# Altium project daq.PrjPcb
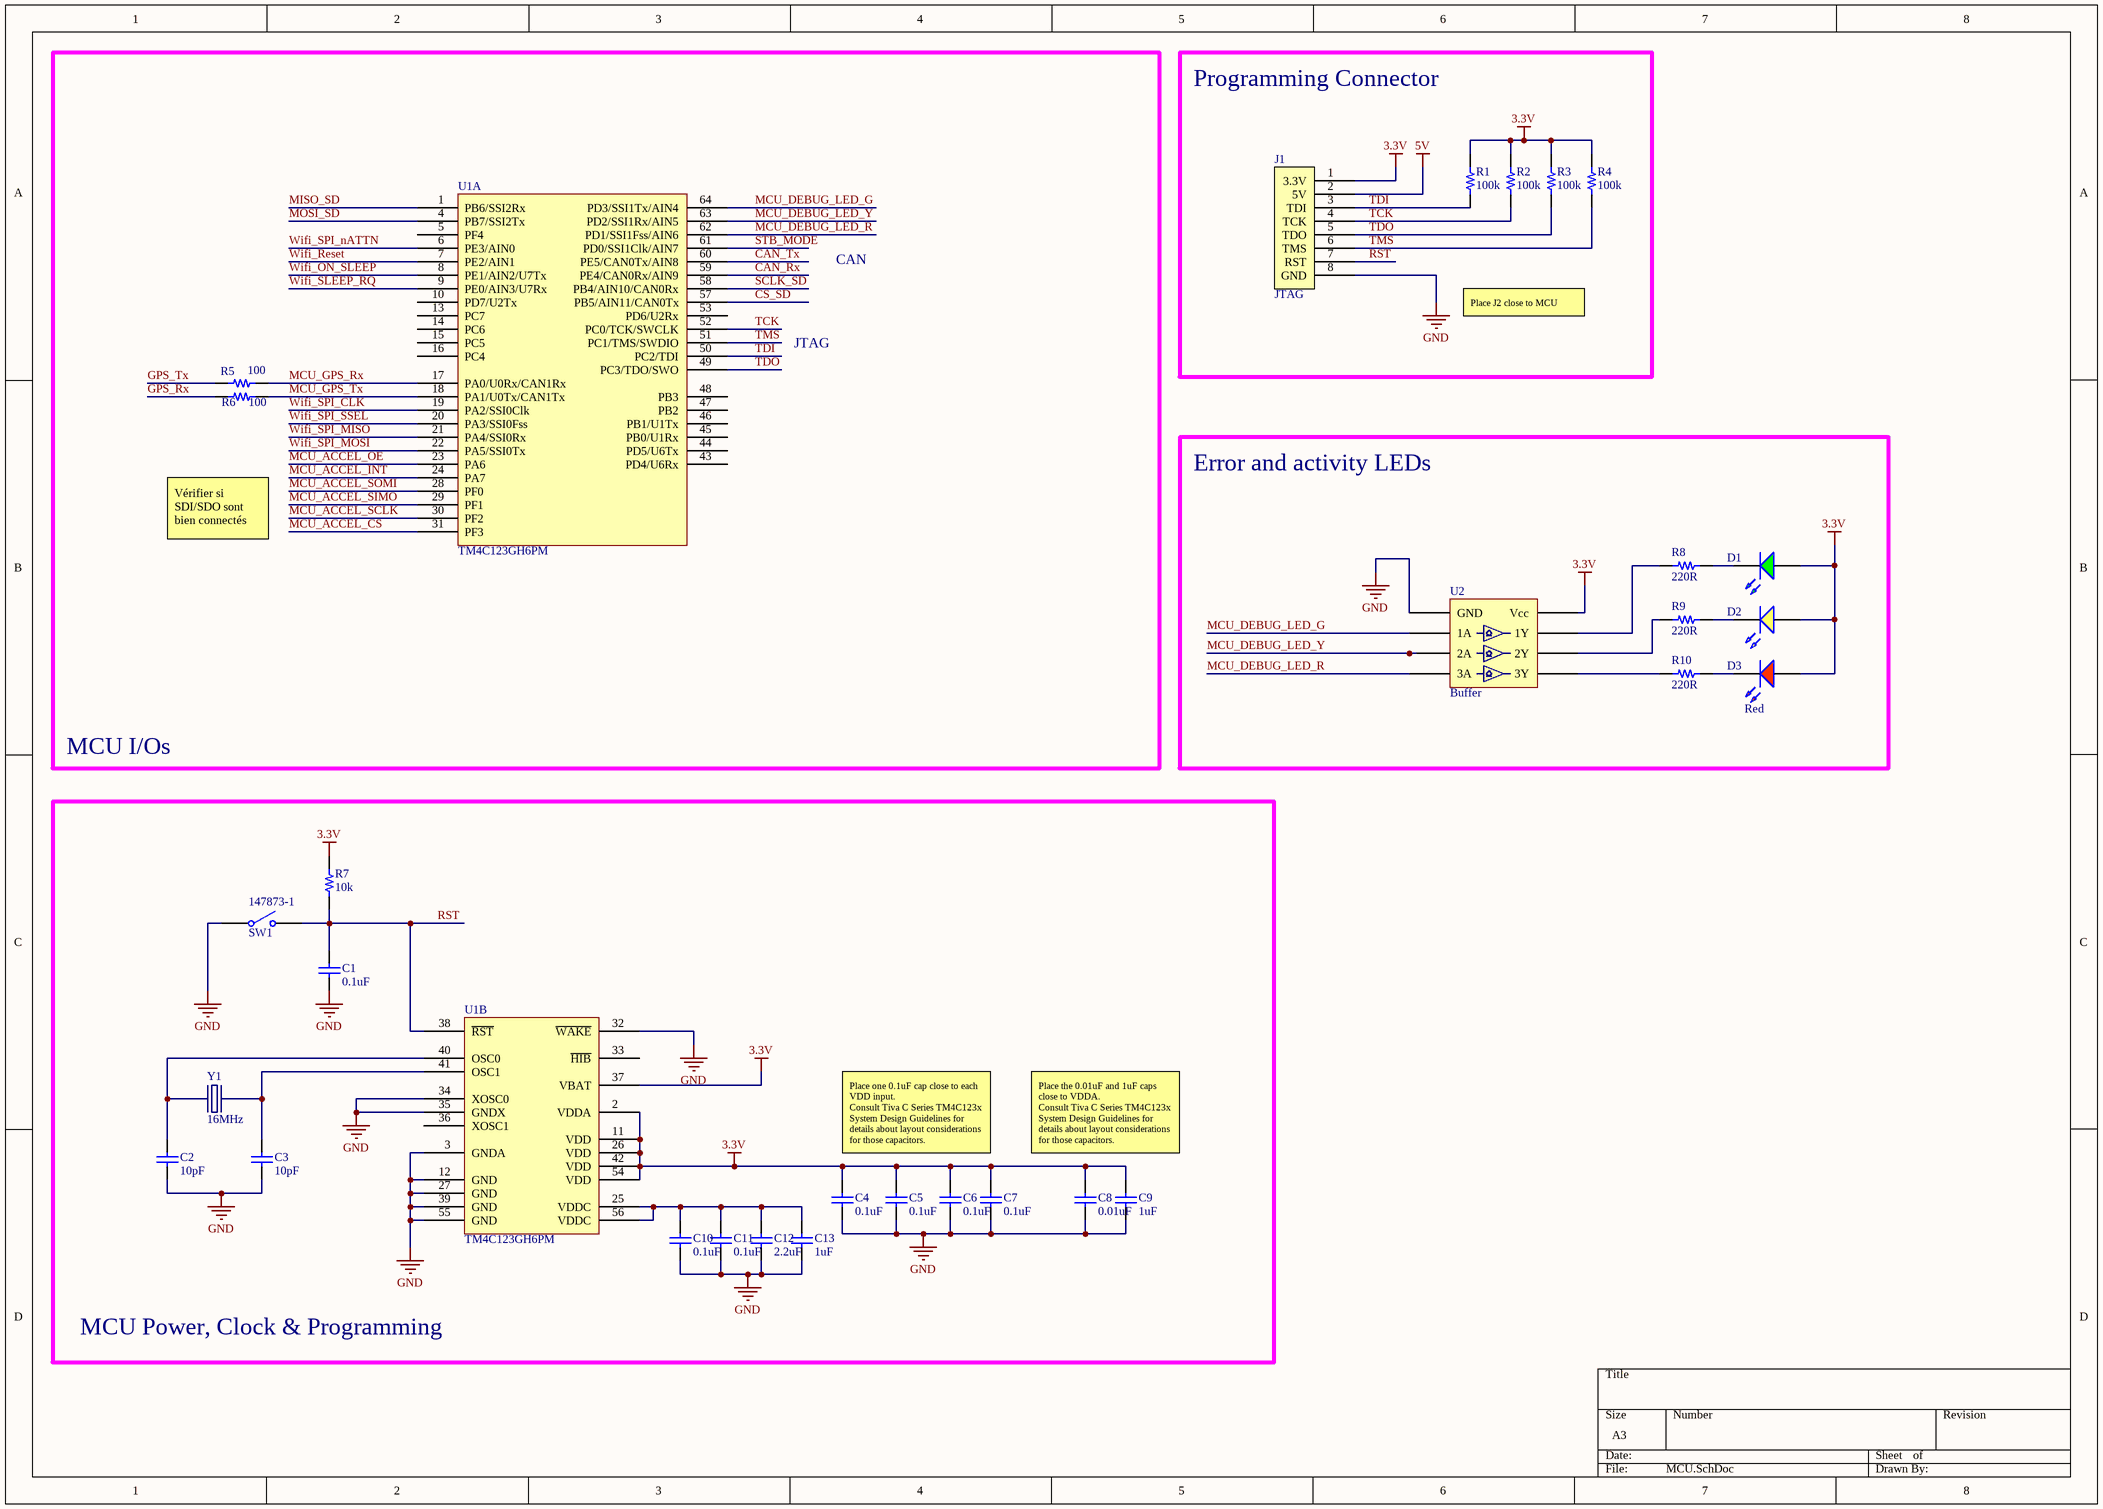
[diagram p0: MCU.SchDoc]
8 sheets, 90 parts. Net scope: global (net labels, ports and power ports of the same name join across sheets).
Board file: daq.PcbDoc
Sheets:
  MCU.SchDoc
  PowerSupplies.SchDoc
  CAN.SchDoc
  Connectors.SchDoc
  WifiModule.SchDoc
  SD_card.SchDoc
  Accelerometer.SchDoc
  GPS.SchDoc

## Sheet MCU.SchDoc
size A3

### Parts
C1  value 0.1uF  [C0603]  (hidden comment: CAP CER 0603 0.1uF 50V C0G 10%)
C2  value 10pF  [C0603]  (hidden comment: CAP CER 0603 10pF 50V C0G 5%)
C3  value 10pF  [C0603]  (hidden comment: CAP CER 0603 10pF 50V C0G 5%)
C4  value 0.1uF  [C0603]  (hidden comment: CAP CER 0603 0.1uF 50V C0G 10%)
C5  value 0.1uF  [C0603]  (hidden comment: CAP CER 0603 0.1uF 50V C0G 10%)
C6  value 0.1uF  [C0603]  (hidden comment: CAP CER 0603 0.1uF 50V C0G 10%)
C7  value 0.1uF  [C0603]  (hidden comment: CAP CER 0603 0.1uF 50V C0G 10%)
C8  value 0.01uF  [C0603]  (hidden comment: CAP CER 0603 0.01uF 50V X7R 10%)
C9  value 1uF  [C0603]  (hidden comment: CAP CER 0603 1uF 25V X7R 20%)
C10  value 0.1uF  [C0603]  (hidden comment: CAP CER 0603 0.1uF 50V C0G 10%)
C11  value 0.1uF  [C0603]  (hidden comment: CAP CER 0603 0.1uF 50V C0G 10%)
C12  value 2.2uF  [C0603]  (hidden comment: CAP CER 0603 2.2uF 6.3V X7R 10%)
C13  value 1uF  [C0603]  (hidden comment: CAP CER 0603 1uF 25V X7R 20%)
D1  Green LED  [LED1206]  (value not drawn)
D2  Yellow  [LED1206]  (value not drawn)
D3  Red  [LED1206]
J1  JTAG  [JTAG_Header]
R1  value 100k  [R0603]  (hidden comment: RES 0603 100k 5% 0.1W)
R2  value 100k  [R0603]  (hidden comment: RES 0603 100k 5% 0.1W)
R3  value 100k  [R0603]  (hidden comment: RES 0603 100k 5% 0.1W)
R4  value 100k  [R0603]  (hidden comment: RES 0603 100k 5% 0.1W)
R5  value 100  [R0603]  (hidden comment: RES 0603 100R 5% 1/4W)
R6  value 100  [R0603]  (hidden comment: RES 0603 100R 5% 1/4W)
R7  value 10k  [R0603]  (hidden comment: RES 0603 10k 5% 0.1W)
R8  value 220R  [R0603]  (hidden comment: RES 0603 220R 5% 0.25W)
R9  value 220R  [R0603]  (hidden comment: RES 0603 220R 5% 0.25W)
R10  value 220R  [R0603]  (hidden comment: RES 0603 220R 5% 0.25W)
SW1  147873-1  [147873]
U1  32-bit MCU  [LQFP-64]  (value not drawn)  (parts A,B of 2)
U2  Buffer  [8-VFSOP - TI - DCM (S-PDSO-G8)]
Y1  value 16MHz  [NX5032GA]  (hidden comment: NX5043GA-16.00MHz)

### Blocks framed on the sheet
MCU I/Os: R5 R6 U1
Programming Connector: J1 R1-R4
Error and activity LEDs: D1-D3 R8-R10 U2
MCU Power, Clock & Programming: C1-C13 R7 SW1 U1 Y1

### Nets
3.3V: C4.2 C5.2 C6.2 C7.2 C8.2 C9.2 D1.1(A) D2.1(A) D3.1(A) J1.1(3.3V) R1.2 R2.2 R3.2 R4.2 R7.2 U1.2(VDDA) U1.11(VDD) U1.26(VDD) U1.37(VBAT) U1.42(VDD) U1.54(VDD) U2.8(Vcc)
5V: J1.2(5V)
GND: C1.1 C2.1 C3.1 C4.1 C5.1 C6.1 C7.1 C8.1 C9.1 C10.1 C11.1 C12.1 C13.1 J1.8(GND) SW1.1(COMMON) U1.3(GNDA) U1.12(GND) U1.27(GND) U1.32(~{WAKE}) U1.34(XOSC0) U1.35(GNDX) U1.39(GND) U1.55(GND) U2.4(GND)
CAN_Rx: U1.59(PE4/CAN0Rx/AIN9)
CAN_Tx: U1.60(PE5/CAN0Tx/AIN8)
CS_SD: U1.57(PB5/AIN11/CAN0Tx)
GPS_Rx: R6.2
GPS_Tx: R5.2
MCU_ACCEL_CS: U1.31(PF3)
MCU_ACCEL_INT: U1.24(PA7)
MCU_ACCEL_OE: U1.23(PA6)
MCU_ACCEL_SCLK: U1.30(PF2)
MCU_ACCEL_SIMO: U1.29(PF1)
MCU_ACCEL_SOMI: U1.28(PF0)
MCU_DEBUG_LED_G: U1.64(PD3/SSI1Tx/AIN4) U2.1(1A)
MCU_DEBUG_LED_R: U1.62(PD1/SSI1Fss/AIN6) U2.6(3A)
MCU_DEBUG_LED_Y: U1.63(PD2/SSI1Rx/AIN5) U2.3(2A)
MCU_GPS_Rx: R5.1 U1.17(PA0/U0Rx/CAN1Rx)
MCU_GPS_Tx: R6.1 U1.18(PA1/U0Tx/CAN1Tx)
MISO_SD: U1.1(PB6/SSI2Rx)
MOSI_SD: U1.4(PB7/SSI2Tx)
RST: C1.2 J1.7(RST) R7.1 SW1.2(NO) U1.38(~{RST})
SCLK_SD: U1.58(PB4/AIN10/CAN0Rx)
STB_MODE: U1.61(PD0/SSI1Clk/AIN7)
TCK: J1.4(TCK) R2.1 U1.52(PC0/TCK/SWCLK)
TDI: J1.3(TDI) R1.1 U1.50(PC2/TDI)
TDO: J1.5(TDO) R3.1 U1.49(PC3/TDO/SWO)
TMS: J1.6(TMS) R4.1 U1.51(PC1/TMS/SWDIO)
Wifi_ON_SLEEP: U1.8(PE1/AIN2/U7Tx)
Wifi_Reset: U1.7(PE2/AIN1)
Wifi_SLEEP_RQ: U1.9(PE0/AIN3/U7Rx)
Wifi_SPI_CLK: U1.19(PA2/SSI0Clk)
Wifi_SPI_MISO: U1.21(PA4/SSI0Rx)
Wifi_SPI_MOSI: U1.22(PA5/SSI0Tx)
Wifi_SPI_nATTN: U1.6(PE3/AIN0)
Wifi_SPI_SSEL: U1.20(PA3/SSI0Fss)
NetC2_2: C2.2 U1.40(OSC0) Y1.1
NetC3_2: C3.2 U1.41(OSC1) Y1.2
NetC10_2: C10.2 C11.2 C12.2 C13.2 U1.25(VDDC) U1.56(VDDC)
NetD1_2: D1.2(K) R8.2
NetD2_2: D2.2(K) R9.2
NetD3_2: D3.2(K) R10.2
NetR8_1: R8.1 U2.7(1Y)
NetR9_1: R9.1 U2.5(2Y)
NetR10_1: R10.1 U2.2(3Y)

Not connected (* = marked no-connect by the designer): U1 5(PF4) 10(PD7/U2Tx) 13(PC7) 14(PC6) 15(PC5) 16(PC4) 33(~{HIB}) 36(XOSC1) 43(PD4/U6Rx) 44(PD5/U6Tx) 45(PB0/U1Rx) 46(PB1/U1Tx) 47(PB2) 48(PB3) 53(PD6/U2Rx)

### Notes on the sheet
- CAN
- Place J2 close to MCU
- JTAG
- Vérifier si SDI/SDO sont bien connectés
- Place one 0.1uF cap close to each VDD input.
  Consult Tiva C Series TM4C123x System Design Guidelines for details about layout considerations for those capacitors.
- Place the 0.01uF and 1uF caps close to VDDA.
  Consult Tiva C Series TM4C123x System Design Guidelines for details about layout considerations for those capacitors.

### Library data of the parts
C1 C4-C7 C10 C11 = CAP CER 0603 0.1uF 50V C0G 10%: 0.1uF ceramic capacitor; Manufacturer: TDK Corporation; Part_Number: CGA3E2X7R1H104K080AA; Supplier_Link: http://www.digikey.ca/product-detail/en/CGA3E2X7R1H104K080AA/445-5666-1-ND/2443706; Tolerance: 10%; Voltage rating: 50V; Price: 0.14; Price_10: 0.102
C2 C3 = CAP CER 0603 10pF 50V C0G 5%: 10pF ceramic capacitor; Manufacturer: TDK Corporation; Part_Number: CGA3E2C0G1H100D080AA; Supplier_Link: http://www.digikey.ca/product-detail/en/CGA3E2C0G1H100D080AA/445-5628-1-ND/2443668; Tolerance: 5%; Voltage rating: 50V; Price: 0.14; Price_10: 0.077
C8 = CAP CER 0603 0.01uF 50V X7R 10%: 0.01uF ceramic capacitor; Manufacturer: TDK Corporation; Part_Number: CGA3E2X7R1H103K080AA; Supplier_Link: http://www.digikey.ca/product-detail/en/CGA3E2X7R1H103K080AA/445-5662-1-ND/2443702; Tolerance: 10%; Voltage rating: 50V; Price: 0.14; Price_10: 0.102
C9 C13 = CAP CER 0603 1uF 25V X7R 20%: 1uF ceramic capacitor; Manufacturer: TDK Corporation; Part_Number: CGA3E1X7R1E105M080AC; Supplier_Link: http://www.digikey.ca/product-detail/en/CGA3E1X7R1E105M080AC/445-12548-1-ND/3954214; Tolerance: 20%; Voltage rating: 25V; Price: 0.24; Price_10: 0.171
C12 = CAP CER 0603 2.2uF 6.3V X7R 10%: 2.2uF ceramic capacitor; Manufacturer: TDK Corporation; Part_Number: CGA3E1X7R0J225K080AC; Supplier_Link: http://www.digikey.ca/product-detail/en/CGA3E1X7R0J225K080AC/445-6933-1-ND/2672951; Tolerance: 10%; Voltage rating: 6.3V; Price: 0.34; Price_10: 0.235
D1 = LTST-C150KGKT: Green LED 1206; Manufacturer: Liteon; Supplier_Link: http://www.digikey.ca/product-detail/en/LTST-C150KGKT/160-1404-1-ND/386759; Price: 0.55; Price_10: 0.40; Part_Number: LTST-C150KGKT
D2 = LTST-C150KSKT: Yellow LED 1206; Manufacturer: Liteon; Supplier_Link: http://www.digikey.ca/product-detail/en/LTST-C150KSKT/160-1406-1-ND/386762; Price: 0.55; Price_10: 0.40; Part_Number: LTST-C150KSKT
D3 = LTST-C150KRKT: Red LED 1206; Manufacturer: Liteon; Supplier_Link: http://www.digikey.ca/product-detail/en/LTST-C150KRKT/160-1405-1-ND/386760; Price: 0.55; Price_10: 0.40; Part_Number: LTST-C150KRKT
J1 = JTAG_Header: JTAG header, MCU programming
R1-R4 = RES 0603 100k 5% 0.1W: 100 kOhm resistor; Part_Number: CRCW0603100KJNEA; Manufacturer: Vishay; Price: 0.15; Supplier_Link: http://www.digikey.ca/product-detail/en/CRCW0603100KJNEA/541-100KGCT-ND/1179417; Price_10: 0.033
R5 R6 = RES 0603 100R 5% 1/4W: 100 Ohms resistor, 1/4W; Part_Number: ESR03EZPJ101; Manufacturer: Rohm Semiconductor; Price: 0.15; Supplier_Link: http://www.digikey.ca/product-detail/en/ESR03EZPJ101/RHM100DCT-ND/1983776; Price_10: 0.12
R7 = RES 0603 10k 5% 0.1W: 10 kOhms resistor; Part_Number: CRCW060310K0JNEA; Manufacturer: Vishay; Price: 0.15; Supplier_Link: http://www.digikey.ca/product-detail/en/CRCW060310K0JNEA/541-10KGCT-ND/1179393; Price_10: 0.033
R8-R10 = RES 0603 220R 5% 0.25W: 220 Ohms 0.25W Resistor; Part_Number: ESR03EZPJ221; Manufacturer: Rohm Semiconductor; Price: 0.15; Supplier_Link: http://www.digikey.ca/product-detail/en/ESR03EZPJ221/RHM220DCT-ND/1983788; Power: 0.25W; Supplier 1: Digi-Key; Supplier Part Number 1: RHM220DCT-ND; Tolerance: 5%
SW1 = 147873-1: Pushbutton switch SPST, 2 pins; Manufacturer: TE Connectivity; Supplier_Link: http://ca.mouser.com/ProductDetail/TE-Connectivity-Alcoswitch/147873-1/?qs=sGAEpiMZZMvxtGF7dlGNpsxRhg8g8FqHC2R98arEfD8%3d; Price: 0.30; Part_Number: 147873-1
U1 = TM4C123GH6PM: High performance 32-bit ARM® Cortex®-M4F based MCU; Manufacturer: Texas Instruments; Sample_Link: http://www.ti.com/product/TM4C123GH6PM/samplebuy; Supplier 1: Digi-Key; Supplier Part Number 1: 296-35848-ND; Supplier_Link: http://www.digikey.ca/product-detail/en/TM4C123GH6PMI/296-35848-ND/4036462; Price: 16.430; Price_10: 14.8320; Part_Number: TM4C123GH6PM
U2 = SN74LVC3G07-Q1: Triple Buffer/Driver  With Open-drain Outputs; Manufacturer: Texas Instrument; Part_Number: SN74LVC3G07QDCURQ1; Sink current: 32 mA @ 4.5V; Note: Q1 (automotive) version only available in TSSOP50 footpring; Supplier 1: Digi-Key; Supplier Part Number 1: 296-23710-1-ND; Supplier_Link: http://www.digikey.ca/product-detail/en/texas-instruments/SN74LVC3G07QDCURQ1/296-23710-1-ND/1948115; Price: 0.94; Price_10: 0.811
Y1 = NX5043GA-16.00MHz: Crystal Oscillator 16 MHz; Manufacturer: NDK; Part_Number: NX5032GA-16.000M-LN-CD-1; ESR: 120 Ohms; Supplier_Link: http://www.digikey.ca/product-detail/en/NX5032GA-16.000000MHZ-LN-CD-1/644-1037-1-ND/1128909; Price: 0.95; Price_10: 0.796

## Sheet PowerSupplies.SchDoc
size A4
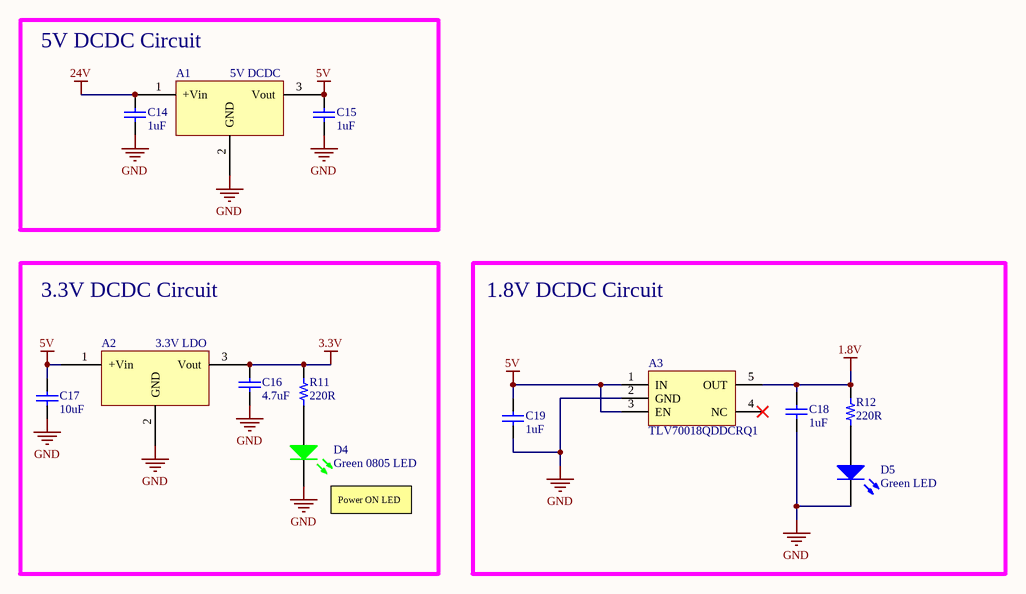
[diagram p1: PowerSupplies.SchDoc]

### Parts
A1  5V DCDC  [R-78E-0.5]
A2  3.3V LDO  [TO252-3]
A3  TLV70018QDDCRQ1  [SOT-23-5]
C14  value 1uF  [C0603]  (hidden comment: CAP CER 0603 1uF 25V X7R 20%)
C15  value 1uF  [C0603]  (hidden comment: CAP CER 0603 1uF 25V X7R 20%)
C16  value 4.7uF  [C0603]  (hidden comment: CAP CER 0603 4.7uF 25V X7R 10%)
C17  value 10uF  [C0603]  (hidden comment: CAP CER 0603 10uF 6.3V X5R 20%)
C18  value 1uF  [C0603]  (hidden comment: CAP CER 0603 1uF 16V X7R 10%)
C19  value 1uF  [C0603]  (hidden comment: CAP CER 0603 1uF 16V X7R 10%)
D4  Green 0805 LED  [LED0805]
D5  Green LED  [LED0603]
R11  value 220R  [R0603]  (hidden comment: RES 0603 220R 5% 0.25W)
R12  value 220R  [R0603]  (hidden comment: RES 0603 220R 5% 0.25W)

### Blocks framed on the sheet
5V DCDC Circuit: A1 C14 C15
3.3V DCDC Circuit: A2 C16 C17 D4 R11
1.8V DCDC Circuit: A3 C18 C19 D5 R12

### Nets
1.8V: A3.5(OUT) C18.2 R12.2
3.3V: A2.3(Vout) C16.2 R11.2
5V: A1.3(Vout) A2.1(+Vin) A3.1(IN) A3.3(EN) C15.2 C17.2 C19.2
24V: A1.1(+Vin) C14.2
GND: A1.2(GND) A2.2(GND) A3.2(GND) C14.1 C15.1 C16.1 C17.1 C18.1 C19.1 D4.1(K) D5.1(K)
NetD4_2: D4.2(A) R11.1
NetD5_2: D5.2(A) R12.1

Not connected (* = marked no-connect by the designer): A3 4(NC)*

### Notes on the sheet
- (near D4) Power ON LED

### Library data of the parts
A1 = R78E5.0-0.5: Manufacturer: Recom; Part_Number: R-78E5.0-0.5; Vin: 7-28V; Iout: 500mA; Efficiency: 82-92%; Supplier_Link: http://www.digikey.ca/product-detail/en/R-78E5.0-0.5/945-1648-5-ND/2834904; Vout: 5V; Price: 4.04; Price_10: 3.972
A2 = NCV5501DT33RKG: Linear Voltage Regulator IC Positive Fixed 1 Output 3.3V 500mA DPAK-3; Manufacturer: ON Semiconductor; Iout: 500 mA; Price: 1.33; Price_10: 1.194; Supplier 1: Digi-Key; Supplier_Link: http://www.digikey.ca/product-detail/en/on-semiconductor/NCV5501DT33RKG/NCV5501DT33RKGOSCT-ND/3462418; Supplier Part Number 1: NCV5501DT33RKGOSCT-ND; Vout: 3.3V; Part_Number: NCV5501DT33RKG
A3 = TLV70018QDDCRQ1: Linear Voltage Regulator IC Positive Fixed 1 Output 1.8V 300mA SOT-23-5; Manufacturer: Texas Instruments; Part_Number: TLV70018QDDCRQ1; Supplier_Link: https://www.digikey.ca/product-detail/en/texas-instruments/TLV70018QDDCRQ1/296-36761-1-ND/4341463
C14 C15 = CAP CER 0603 1uF 25V X7R 20%: as C9 on sheet MCU; Supplier_Link: http://www.digikey.ca/product-detail/en/CGA3E1X7R1E105M080AC/445-12548-1-ND/3954214; Tolerance: 20%; Voltage rating: 25V; Price: 0.24; Price_10: 0.171
C16 = CAP CER 0603 4.7uF 25V X7R 10%: 4.7uF ceramic capacitor; Manufacturer: Kernet; Part_Number: C1206C475K3RACAUTO; Supplier_Link: http://www.digikey.ca/product-detail/en/CGA3E3X7R1E474K080AB/445-6929-1-ND/2672947; Tolerance: 10%; Voltage rating: 25V; Price: 0.48; Supplier 1: Digi-Key; Supplier Part Number 1: 399-7029-1-ND; Price_10: 0.428
C17 = CAP CER 0603 10uF 6.3V X5R 20%: 10uF ceramic capacitor; Manufacturer: Taiyo Yuden; Part_Number: JMK107ABJ106MAHT; Supplier_Link: http://www.digikey.ca/product-detail/en/JMK107ABJ106MAHT/587-3383-1-ND/4157249; Tolerance: 20%; Voltage rating: 6.3V; Price: 0.30; Supplier 1: Digi-Key; Supplier Part Number 1: 587-3383-1-ND; Price_10: 0.205
C18 C19 = CAP CER 0603 1uF 16V X7R 10%: 1uF ceramic capacitor; Manufacturer: Samsung Electro-Mechanics; Part_Number: CL10B105KO8VPNC; Supplier_Link: https://www.digikey.ca/product-detail/en/samsung-electro-mechanics/CL10B105KO8VPNC/1276-6613-1-ND/5961472; Tolerance: 10%; Voltage rating: 16V; Price: 0.32; Supplier 1: Digi-Key; Supplier Part Number 1: 1276-6613-1-ND
D4 = APT2012LZGCK: Green 525nm LED Indication - Discrete 2.65V 0805 (2012 Metric); Manufacturer: Kingbright; Forward_Voltage: 2.65; Supplier_Link: http://www.digikey.ca/product-detail/en/kingbright/APT2012LZGCK/754-1939-1-ND/5177469; Price: 0.86; Price_10: 0.673; Part_Number: APT2012LZGCK; Supplier 1: Digi-Key; Supplier Part Number 1: 754-1939-1-ND
D5 = 150060VS75000: Green LED 0603, 2V, 20mA; Manufacturer: Wurth Electronics; Supplier_Link: http://www.digikey.ca/product-detail/en/wurth-electronics-inc/150060VS75000/732-4980-1-ND/4489904; Price: 0.34; Price_10: 0.3968; Part_Number: 150060VS75000
R11 R12 = RES 0603 220R 5% 0.25W: as R8 on sheet MCU; Price: 0.15; Supplier_Link: http://www.digikey.ca/product-detail/en/ESR03EZPJ221/RHM220DCT-ND/1983788; Power: 0.25W; Supplier 1: Digi-Key; Supplier Part Number 1: RHM220DCT-ND; Tolerance: 5%
  R11: Price_10: 0.12

## Sheet CAN.SchDoc
size A4
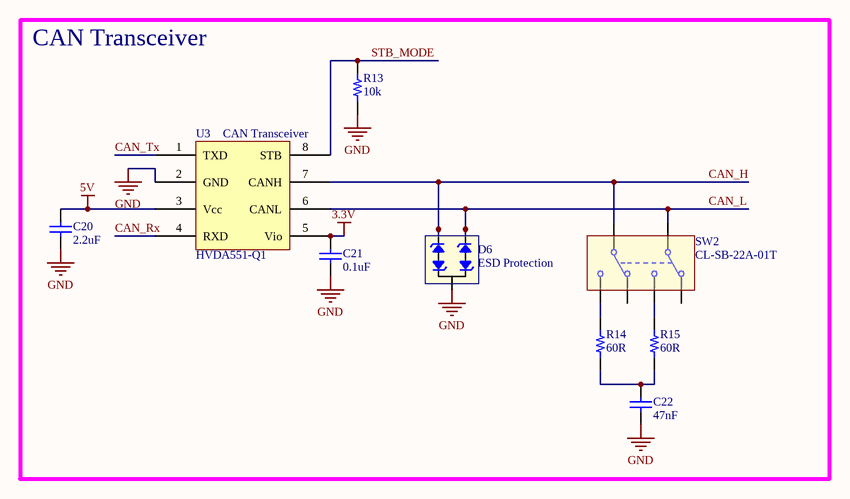
[diagram p2: CAN.SchDoc]

### Parts
C20  value 2.2uF  [C0603]  (hidden comment: CAP CER 0603 2.2uF 6.3V X7R 10%)
C21  value 0.1uF  [C0603]  (hidden comment: CAP CER 0603 0.1uF 50V C0G 10%)
C22  value 47nF  [C0603]  (hidden comment: CAP CER 0603 47nF 50V X7R 10%)
D6  ESD Protection  [SOT323]
R13  value 10k  [R0603]  (hidden comment: RES 0603 10k 1% 0.1W)
R14  value 60R  [R0603]  (hidden comment: RES 0603 60R 1% 0.25W)
R15  value 60R  [R0603]  (hidden comment: RES 0603 60R 1% 0.25W)
SW2  CL-SB-22A-01T  [CL-SB-22A-01T]
U3  CAN Transceiver  [SOIC-8]

### Blocks framed on the sheet
CAN Transceiver: C20-C22 D6 R13-R15 SW2 U3

### Nets
3.3V: C21.2 U3.5(Vio)
5V: C20.2 U3.3(Vcc)
GND: C20.1 C21.1 C22.2 D6.3 R13.1 U3.2(GND)
CAN_H: D6.2 SW2.5(COMMON2) U3.7(CANH)
CAN_L: D6.1 SW2.2(COMMON1) U3.6(CANL)
CAN_Rx: U3.4(RXD)
CAN_Tx: U3.1(TXD)
STB_MODE: R13.2 U3.8(STB)
NetC22_1: C22.1 R14.1 R15.1
NetR14_2: R14.2 SW2.6(NO2)
NetR15_2: R15.2 SW2.3(NO1)

Not connected (* = marked no-connect by the designer): SW2 1(NC1) 4(NC2)

### Library data of the parts
C20 = CAP CER 0603 2.2uF 6.3V X7R 10%: as C12 on sheet MCU; Tolerance: 10%; Voltage rating: 6.3V; Price: 0.34; Supplier_Link: http://www.digikey.ca/product-detail/en/CGA3E1X7R0J225K080AC/445-6933-1-ND/2672951; Supplier 1: Digi-Key; Supplier Part Number 1: 445-6933-1-ND
C21 = CAP CER 0603 0.1uF 50V C0G 10%: 0.1uF ceramic capacitor; Manufacturer: Murata Electronics North America; Part_Number: GCM188R71H104KA57D; Tolerance: 10%; Voltage rating: 50V; Supplier_Link: https://www.digikey.ca/product-detail/en/murata-electronics-north-america/GCM188R71H104KA57D/490-4779-1-ND/1641698; Price: 0.45; Supplier 1: Digi-Key; Supplier Part Number 1: 490-4779-1-ND
C22 = CAP CER 0603 47nF 50V X7R 10%: 47nF ceramic capacitor; Manufacturer: Murata Electronics North America; Part_Number: GCJ188R71H473KA12D; Tolerance: 10%; Voltage rating: 50V; Price: 0.45; Supplier_Link: https://www.digikey.ca/product-detail/en/murata-electronics-north-america/GCJ188R71H473KA12D/490-5854-1-ND/2785840; Supplier 1: Digi-Key; Supplier Part Number 1: 490-5854-1-ND
D6 = PESD1CAN-UX: CAN bus ESD protection diode; Manufacturer: NXP; Part_Number: PESD1CAN-UX; Price: 0.51; Supplier_Link: http://www.digikey.ca/product-detail/en/nxp-semiconductors/PESD1CAN-UX/568-10731-1-ND/4386316; Price_10: 0.417; Supplier 1: Digi-Key; Supplier Part Number 1: 568-10731-2-ND
R13 = RES 0603 10k 1% 0.1W: 10 kOhms 1% 0.1W Resistor; Manufacturer: Panasonic Electronic Components; Part_Number: ERJ-3EKF1002V; Supplier_Link: https://www.digikey.ca/product-detail/en/panasonic-electronic-components/ERJ-3EKF1002V/P10.0KHCT-ND/198102; Power: 0.1W; Price_10: 0.095; Tolerance: 1%; Supplier 1: Digi-Key; Supplier Part Number 1: P10.0KHCT-ND
R14 R15 = RES 0603 60R 1% 0.25W: 60 Ohms 0.25W Resistor; Part_Number: ESR03EZPJ620; Manufacturer: Rohm Semiconductor; Tolerance: 5%; Price: 0.15; Supplier_Link: http://www.digikey.ca/product-detail/en/ESR03EZPJ620/RHM62DCT-ND/1983794; Power: 0.25W; Supplier 1: Digi-Key; Supplier Part Number 1: RHM62DCT-ND
SW2 = CL-SB-22A-01T: SWITCH SLIDE DPDT 200MA 12VDC; Manufacturer: Copal Electronics Inc.; Supplier_Link: http://www.digikey.ca/product-detail/en/copal-electronics-inc/CL-SB-22A-01T/563-1338-1-ND/3507893; Price: 1.4; Price_10: 1.347; Supplier 1: Digi-Key; Supplier Part Number 1: 563-1338-1-ND; Part_Number: CL-SB-22A-01T
U3 = HVDA551-Q1: Automotive 5-V CAN Transceiver with I/O Level Adapting and Low-Power Mode Supply Optimization; Manufacturer: Texas Instrument; Supplier 1: Digi-Key; Supplier Part Number 1: 296-40116-1-ND; Supplier_Link: http://www.digikey.ca/product-detail/en/HVDA551QDRQ1/296-40116-1-ND/5177993; Part_Number: HVDA551-Q1; Sample_Link: http://www.ti.com/product/HVDA551-Q1/samplebuy; Price: 2.450; Price_10: 2.201

## Sheet Connectors.SchDoc
size A4
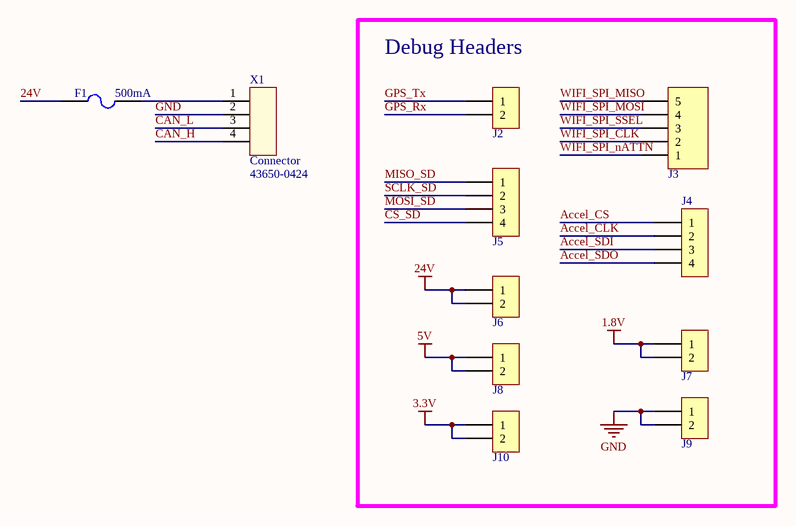
[diagram p3: Connectors.SchDoc]

### Parts
F1  value 500mA  [154_OMNI-BLOK]  (hidden comment: Fuse Holder)
J2  Header 2  [HDR1X2]  (value not drawn)
J3  Header, Xbee SPI  [HDR1X5]  (value not drawn)
J4  Header 4  [HDR1X4]  (value not drawn)
J5  SD SPI  [HDR1X4]  (value not drawn)
J6  Header for debugging  [HDR1X2]  (value not drawn)
J7  Header for debugging  [HDR1X2]  (value not drawn)
J8  Header for debugging  [HDR1X2]  (value not drawn)
J9  Header for debugging  [HDR1X2]  (value not drawn)
J10  Header for debugging  [HDR1X2]  (value not drawn)
X1  Connector  Part_Number: 43650-0424  [43650-0400]

### Blocks framed on the sheet
Debug Headers: J2-J10

### Nets
1.8V: J7.1 J7.2
3.3V: J10.1 J10.2
5V: J8.1 J8.2
24V: F1.2 J6.1 J6.2
GND: J9.1 J9.2 X1.2
Accel_CLK: J4.2
Accel_CS: J4.1
Accel_SDI: J4.3
Accel_SDO: J4.4
CAN_H: X1.4
CAN_L: X1.3
CS_SD: J5.4
GPS_Rx: J2.2
GPS_Tx: J2.1
MISO_SD: J5.1
MOSI_SD: J5.3
SCLK_SD: J5.2
Wifi_SPI_CLK: J3.2
Wifi_SPI_MISO: J3.5
Wifi_SPI_MOSI: J3.4
Wifi_SPI_nATTN: J3.1
Wifi_SPI_SSEL: J3.3
NetF1_1: F1.1 X1.1

### Library data of the parts
F1 = 0453.500MR: 500mA Surface Mount Fuses 453 Series NANO2® Very Fast-Acting Fuse; Part_Number: 0154010.DR; Manufacturer: Littelfuse Inc.; Rated_Voltage_DC: 125V; Part_Number_Fuse: 0453.500MR; Supplier_Link_Fuse: http://www.digikey.ca/product-detail/en/0453.500MR/F3135CT-ND/1984431; Supplier_Link: http://www.digikey.ca/product-detail/en/0154010.DR/F1251CT-ND/565519; Supplier 1: Digi-Key; Supplier Part Number 1: F1251CT-ND; Supplier 2: Digi-Key; Supplier Part Number 2: F3135CT-ND
J2 J6-J10 = Header 2: Header, 2-Pin
J3 = Header 5: Header, 5-Pin
J4 J5 = Header 4: Header, 4-Pin
X1 = 43650-0400: Molex Micro-Fit 3.0, 4 Circuits, Single Row, Right-Angle Through-Hole Header, 3.00mm Pitch, with Solder Tab, Tin, Glow Wire Capable, Black; Part_Number_Crimp: 43030-0001; Part_Number_Mating: 43645-0400; Manufacturer: Molex, LLC; Mounting_Type: SMD, Vertical; Supplier_Link: http://www.digikey.ca/product-detail/en/molex-llc/0436500424/WM2629CT-ND/1634981; Supplier_Link_Crimp: http://www.digikey.ca/product-detail/en/molex-llc/0430300001/WM1837CT-ND/467810; Supplier_Link_Mating: http://www.digikey.ca/products/en?keywords=43645-0400

## Sheet WifiModule.SchDoc
size A
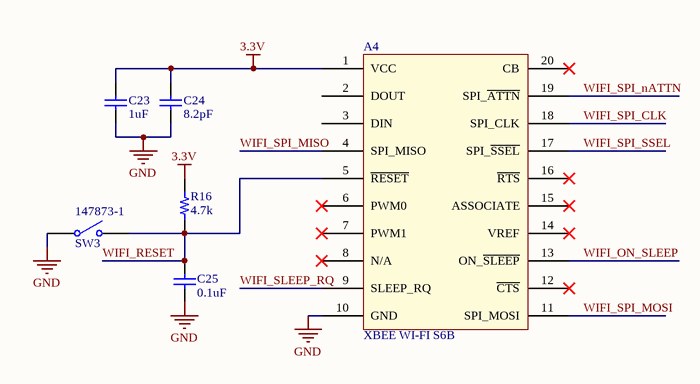
[diagram p4: WifiModule.SchDoc]

### Parts
A4  XBEE WI-FI S6B  [Xbee_TH]
C23  value 1uF  [C0603]  (hidden comment: CAP CER 0603 1uF 25V X7R 20%)
C24  value 8.2pF  [C0603]  (hidden comment: CAP CER 0603 8.2pF 50V COG ±0.5pF)
C25  value 0.1uF  [C0603]  (hidden comment: CAP CER 0603 0.1uF 50V C0G 10%)
R16  value 4.7k  [R0603]  (hidden comment: RES 0603 4.7k 5% 0.1W)
SW3  147873-1  [147873]

### Nets
3.3V: A4.1(VCC) C23.2 C24.2 R16.2
GND: A4.10(GND) C23.1 C24.1 C25.1 SW3.1(COMMON)
Wifi_ON_SLEEP: A4.13(ON_~{SLEEP})
Wifi_Reset: A4.5(~{RESET}) C25.2 R16.1 SW3.2(NO)
Wifi_SLEEP_RQ: A4.9(SLEEP_RQ)
Wifi_SPI_CLK: A4.18(SPI_CLK)
Wifi_SPI_MISO: A4.4(SPI_MISO)
Wifi_SPI_MOSI: A4.11(SPI_MOSI)
Wifi_SPI_nATTN: A4.19(SPI_~{ATTN})
Wifi_SPI_SSEL: A4.17(SPI_~{SSEL})

Not connected (* = marked no-connect by the designer): A4 2(DOUT) 3(DIN) 6(PWM0)* 7(PWM1)* 8(N/A)* 12(~{CTS})* 14(VREF)* 15(ASSOCIATE)* 16(~{RTS})* 20(CB)*

### Library data of the parts
A4 = XBEE WI-FI S6B: Module Wifi; Manufacturer: Digi International; Part_Number: XB2B-WFST-001; Price: 36.19; Supplier 1: Digi-Key; Supplier_Link: http://www.digikey.com/product-search/en?mpart=XB2B-WFST-001&vendor=602; Supplier Part Number 1: 602-1380-ND
C23 = CAP CER 0603 1uF 25V X7R 20%: as C9 on sheet MCU; Supplier_Link: http://www.digikey.ca/product-detail/en/CGA3E1X7R1E105M080AC/445-12548-1-ND/3954214; Tolerance: 20%; Voltage rating: 25V; Price: 0.24; Supplier 1: Digi-Key; Supplier Part Number 1: 445-12548-1-ND; Price_10: 0.171
C24 = CAP CER 0603 8.2pF 50V COG ±0.5pF: 8.2pF 50V Ceramic Capacitor C0G, NP0 0603; Manufacturer: Murata-Electronics-North-America; Part_Number: GCM1885C1H8R2DA16D; Price: 0.15; Price_10: 0.111; Supplier 1: Digi-Key; Supplier_Link: http://www.digikey.ca/product-detail/en/murata-electronics-north-america/GCM1885C1H8R2DA16D/490-11155-1-ND/5332995; Supplier Part Number 1: 490-11155-1-ND; Tolerance: ±0.5pF; Voltage rating: 50V
C25 = CAP CER 0603 0.1uF 50V C0G 10%: as C1 on sheet MCU; Supplier_Link: http://www.digikey.ca/product-detail/en/CGA3E2X7R1H104K080AA/445-5666-1-ND/2443706; Tolerance: 10%; Voltage rating: 50V; Price: 0.14; Price_10: 0.102
R16 = RES 0603 4.7k 5% 0.1W: 4.7 kOhms resistor; Part_Number: CRCW06034K70JNEA; Manufacturer: Vishay; Price: 0.15; Supplier_Link: http://www.digikey.ca/product-detail/en/CRCW06034K70JNEA/541-4.7KGCT-ND/1179385; Price_10: 0.033
SW3 = 147873-1: as SW1 on sheet MCU; Supplier_Link: http://www.te.com/usa-en/product-147873-1.html; Price: 0.30; Part_Number: 147873-1

## Sheet SD_card.SchDoc
size A4
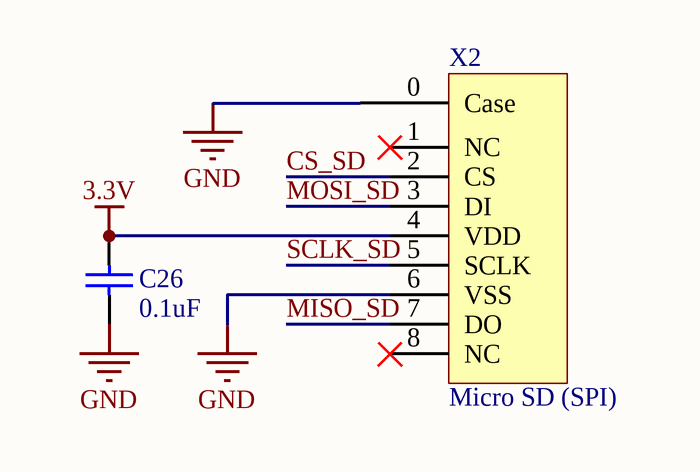
[diagram p5: SD_card.SchDoc]

### Parts
C26  value 0.1uF  [C0603]  (hidden comment: CAP CER 0603 0.1uF 50V C0G 10%)
X2  Micro SD (SPI)  [475710001]

### Nets
3.3V: C26.2 X2.4(VDD)
GND: C26.1 X2.0(Case) X2.6(VSS)
CS_SD: X2.2(CS)
MISO_SD: X2.7(DO)
MOSI_SD: X2.3(DI)
SCLK_SD: X2.5(SCLK)

Not connected (* = marked no-connect by the designer): X2 1(NC)* 8(NC)*

### Library data of the parts
C26 = CAP CER 0603 0.1uF 50V C0G 10%: as C1 on sheet MCU; Supplier_Link: http://www.digikey.ca/product-detail/en/CGA3E2X7R1H104K080AA/445-5666-1-ND/2443706; Tolerance: 10%; Voltage rating: 50V; Price: 0.14; Supplier 1: Digi-Key; Supplier Part Number 1: 445-5666-1-ND; Price_10: 0.102
X2 = 475710001: microSD connector, Surface Mount, Right Angle; Manufacturer: Molex; Part_Number: 47571-0001; Price: 1.39; Price_10: 1.227; Supplier_Link: http://www.digikey.ca/product-search/en/connectors-interconnects/memory-connectors-pc-card-sockets/1442985?k=475710001&k=&pkeyword=475710001&pv7=2&FV=fff40016%2Cfff804a9&mnonly=0&newproducts=0&ColumnSort=0&page=1&stock=1&quantity=0&ptm=0&fid=0&pageSize=25

## Sheet Accelerometer.SchDoc
size A
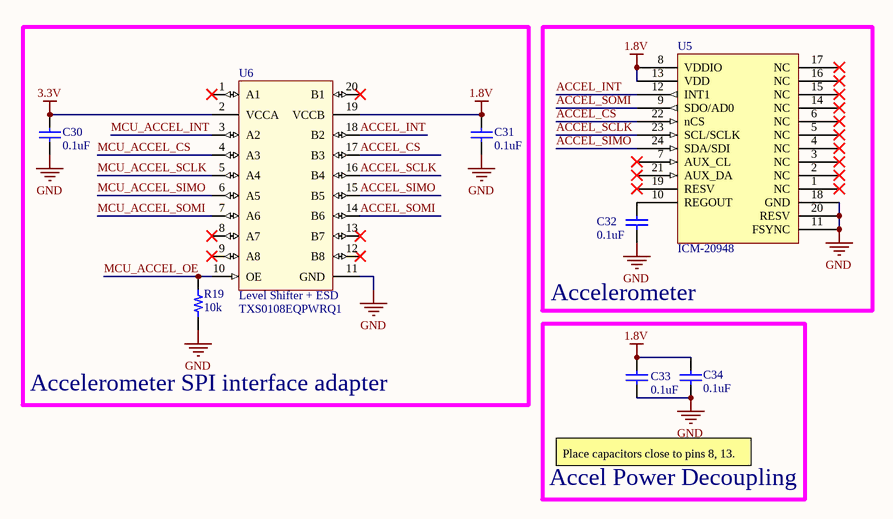
[diagram p6: Accelerometer.SchDoc]

### Parts
C30  value 0.1uF  [C0603]  (hidden comment: CAP CER 0603 0.1uF 50V C0G 10%)
C31  value 0.1uF  [C0603]  (hidden comment: CAP CER 0603 0.1uF 50V C0G 10%)
C32  value 0.1uF  [C0603]  (hidden comment: CAP CER 0603 0.1uF 50V C0G 10%)
C33  value 0.1uF  [C0603]  (hidden comment: CAP CER 0603 0.1uF 50V C0G 10%)
C34  value 0.1uF  [C0603]  (hidden comment: CAP CER 0603 0.1uF 50V C0G 10%)
R19  value 10k  [R0603]  (hidden comment: RES 0603 10k 1% 0.1W)
U5  ICM-20948  [QFN-24]
U6  Level Shifter + ESD  [PW (R-PDSO-G20)]

### Blocks framed on the sheet
Accelerometer SPI interface adapter: C30 C31 R19 U6
Accelerometer: C32 U5

### Nets
1.8V: C31.2 C33.2 C34.2 U5.8(VDDIO) U5.13(VDD) U6.19(VCCB)
3.3V: C30.2 U6.2(VCCA)
GND: C30.1 C31.1 C32.1 C33.1 C34.1 R19.1 U5.11(FSYNC) U5.18(GND) U5.20(RESV) U6.11(GND)
Accel_CS: U5.22(nCS) U6.17(B3)
ACCEL_INT: U5.12(INT1) U6.18(B2)
ACCEL_SCLK: U5.23(SCL/SCLK) U6.16(B4)
ACCEL_SIMO: U5.24(SDA/SDI) U6.15(B5)
ACCEL_SOMI: U5.9(SDO/AD0) U6.14(B6)
MCU_ACCEL_CS: U6.4(A3)
MCU_ACCEL_INT: U6.3(A2)
MCU_ACCEL_OE: R19.2 U6.10(OE)
MCU_ACCEL_SCLK: U6.5(A4)
MCU_ACCEL_SIMO: U6.6(A5)
MCU_ACCEL_SOMI: U6.7(A6)
NetC32_2: C32.2 U5.10(REGOUT)

Not connected (* = marked no-connect by the designer): U5 1(NC)* 2(NC)* 3(NC)* 4(NC)* 5(NC)* 6(NC)* 7(AUX_CL)* 14(NC)* 15(NC)* 16(NC)* 17(NC)* 19(RESV)* 21(AUX_DA)*; U6 1(A1)* 8(A7)* 9(A8)* 12(B8)* 13(B7)* 20(B1)*

### Notes on the sheet
- Accel Power Decoupling
- Place capacitors close to pins 8, 13.

### Library data of the parts
C30 C31 = CAP CER 0603 0.1uF 50V C0G 10%: as C1 on sheet MCU; Supplier_Link: http://www.digikey.ca/product-detail/en/CGA3E2X7R1H104K080AA/445-5666-1-ND/2443706; Tolerance: 10%; Voltage rating: 50V; Price: 0.14; Supplier 1: Digi-Key; Supplier Part Number 1: 445-5666-1-ND
C32-C34 = CAP CER 0603 0.1uF 50V C0G 10%: as C21 on sheet CAN; Supplier_Link: https://www.digikey.ca/product-detail/en/murata-electronics-north-america/GCM188R71H104KA57D/490-4779-1-ND/1641698; Tolerance: 10%; Voltage rating: 50V; Price: 0.45; Supplier 1: Digi-Key; Supplier Part Number 1: 490-4779-1-ND
R19 = RES 0603 10k 1% 0.1W: 10 kOhms 1% 0.1W Resistor; Manufacturer: Vishay Dale; Part_Number: CRCW060310K0FKEA; Supplier_Link: http://www.digikey.ca/product-detail/en/CRCW060310K0FKEA/541-10.0KHCT-ND/1179924; Power: 0.1W; Price_10: 0.125; Tolerance: 1%; Supplier 1: Digi-Key; Supplier Part Number 1: 541-10.0KHCT-ND
U5 = ICM-20948: IMU ACCEL/GYRO/COMPI2C/SPI 24QFN; Manufacturer: TDK InvenSense; Part_Number: ICM-20948; Supplier_Link: https://www.digikey.ca/product-detail/en/tdk-invensense/ICM-20948/1428-1123-1-ND/7062698
U6 = TXS0108EQPWRQ1: Voltage Level Translator, Bidirectional, 1 Circuit 8 Channel, 110Mbps, for Open-Drain and Push-Pull Applications, ESD Protection; Manufacturer: Texas Instruments; Supplier_Link: http://www.digikey.ca/product-detail/en/texas-instruments/TXS0108EQPWRQ1/296-42401-1-ND/5356982; Price: 3.69; Price_10: 3.317; Supplier 1: Digi-Key; Supplier Part Number 1: 296-42401-1-ND; Part_Number: TXS0108EQPWRQ1

## Sheet GPS.SchDoc
size A
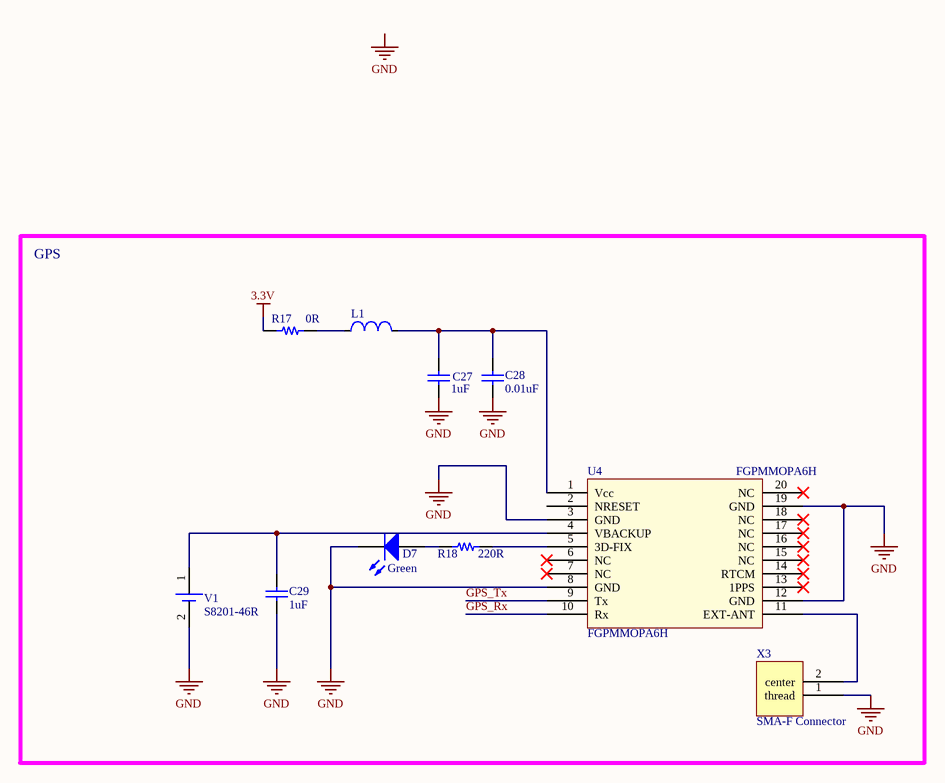
[diagram p7: GPS.SchDoc]

### Parts
C27  value 1uF  [C0603]  (hidden comment: CAP CER 0603 1uF 25V X7R 20%)
C28  value 0.01uF  [C0603]  (hidden comment: CAP CER 0603 0.01uF 50V X7R 10%)
C29  value 1uF  [C0603]  (hidden comment: CAP CER 0603 1uF 16V X7R 10%)
D7  Green  [LED1206]
L1  Ferrite bead 60R@100MHz  [I0805]  (value not drawn)
R17  value 0R  [R0603]  (hidden comment: RES 0603 0R)
R18  value 220R  [R0603]  (hidden comment: RES 0603 220R 5% 1/4W)
U4  FGPMMOPA6H  [FGPMMOPA6H]
V1  S8201-46R  [S8201-46R]
X3  SMA-F Connector  [SMA-F]

### Blocks framed on the sheet
GPS: C27-C29 D7 L1 R17 R18 U4 V1 X3

### Nets
3.3V: R17.1
GND: C27.1 C28.1 C29.1 D7.2(K) U4.3(GND) U4.8(GND) U4.12(GND) U4.19(GND) V1.2 X3.1(thread)
GPS_Rx: U4.10(Rx)
GPS_Tx: U4.9(Tx)
NetC27_2: C27.2 C28.2 L1.2 U4.1(Vcc)
NetC29_2: C29.2 U4.4(VBACKUP) V1.1
NetD7_1: D7.1(A) R18.1
NetL1_1: L1.1 R17.2
NetR18_2: R18.2 U4.5(3D-FIX)
NetU4_11: U4.11(EXT-ANT) X3.2(center)

Not connected (* = marked no-connect by the designer): U4 2(NRESET) 6(NC)* 7(NC)* 13(1PPS)* 14(RTCM)* 15(NC)* 16(NC)* 17(NC)* 18(NC)* 20(NC)*

### Notes on the sheet
- Labels drawn without touching a wire or pin: GND

### Library data of the parts
C27 = CAP CER 0603 1uF 25V X7R 20%: 1uF ceramic capacitor; Manufacturer: TDK Corporation; Manufacturer Part Number: CGA3E1X7R1E105M080AC; Supplier_Link: http://www.digikey.ca/product-detail/en/CGA3E1X7R1E105M080AC/445-12548-1-ND/3954214; Tolerance: 20%; Voltage rating: 25V; Price: 0.24; Supplier 1: Digi-Key; Supplier Part Number 1: 445-12548-1-ND; Part_Number: CGA3E1X7R1E105M080AC
C28 = CAP CER 0603 0.01uF 50V X7R 10%: 0.01uF ceramic capacitor; Manufacturer: TDK Corporation; Manufacturer Part Number: CGA3E2X7R1H103K080AA; Supplier_Link: http://www.digikey.ca/product-detail/en/CGA3E2X7R1H103K080AA/445-5662-1-ND/2443702; Tolerance: 10%; Voltage rating: 50V; Price: 0.14; Supplier 1: Digi-Key; Supplier Part Number 1: 445-5662-1-ND; Part_Number: CGA3E2X7R1H103K080AA
C29 = CAP CER 0603 1uF 16V X7R 10%: as C18 on sheet PowerSupplies; Supplier_Link: https://www.digikey.ca/product-detail/en/samsung-electro-mechanics/CL10B105KO8VPNC/1276-6613-1-ND/5961472; Tolerance: 10%; Voltage rating: 16V; Price: 0.32; Supplier 1: Digi-Key; Supplier Part Number 1: 1276-6613-1-ND
D7 = LTST-C150KGKT: Green LED 1206; Manufacturer: Liteon; Forward Voltage: 2V @ 20 mA; Price: 0.55; Price_10: 0.40; Part_Number: LTST-C150KGKT; Supplier_Link: http://www.digikey.ca/product-detail/en/LTST-C150KGKT/160-1404-1-ND/386759
L1 = BKP2125HS600-T: 0805 Ferrite bead, 60 Ohms at 100 MHz; Manufacturer: Taiyo Yuden; Value: 60 Ohms @ 100 MHz; Current_Rating: 3A; Part_Number: BKP2125HS600-T; Supplier_Link: http://www.digikey.ca/product-detail/en/BKP2125HS600-T/587-1932-1-ND/1465402
R17 = RES 0603 0R: 0 Ohm Resistor; Part_Number: CRCW06030000Z0EA; Manufacturer: Vishay Dale; Power: 0.1W; Price: 0.11; Supplier_Link: http://www.digikey.ca/product-detail/en/CRCW06030000Z0EA/541-0.0GCT-ND/1179296; Supplier 1: Digi-Key; Supplier Part Number 1: 541-0.0GCT-ND; Manufacturer Part Number: CRCW06030000Z0EA
R18 = RES 0603 220R 5% 1/4W: 220 Ohms resistor, 1/4W; Manufacturer: Rohm Semiconductor; Part_Number: ESR03EZPJ221; Supplier_Link: ESR03EZPJ221; Price: 0.15; Supplier_Link: http://www.digikey.ca/product-detail/en/ESR03EZPJ221/RHM220DCT-ND/1983788
U4 = FGPMMOPA6H: GPS Standalone Module; Manufacturer: GlobalTop Technology Inc.; Type: GPS Module; Part_Number: FGPMMOPA6H; Supplier_Link: http://www.adafruit.com/products/790
V1 = S8201-46R: Manufacturer: Harwin Inc.; Part_Number: S8201-46R; Supplier_Link: https://www.digikey.ca/product-detail/en/harwin-inc/S8201-46R/952-1662-1-ND/2627209; Price: 0.68
X3 = 5-1814832-1: SMA Connector Jack, Female Socket 50 Ohm Through Hole Solder; Manufacturer: TE Connectivity AMP Connectors; Supplier_Link: http://www.digikey.ca/product-detail/en/te-connectivity-amp-connectors/5-1814832-1/A97594-ND/1755982; Part_Number: 5-1814832-1; Price: 2.8

## Nets that join several sheets
1.8V: PowerSupplies (A3.5 C18.2 R12.2), Connectors (J7.1 J7.2), Accelerometer (6 pins)
3.3V: MCU (22 pins), PowerSupplies (A2.3 C16.2 R11.2), CAN (C21.2 U3.5), Connectors (J10.1 J10.2), WifiModule (A4.1 C23.2 C24.2 R16.2), SD_card (C26.2 X2.4), Accelerometer (C30.2 U6.2), GPS (R17.1)
5V: MCU (J1.2), PowerSupplies (7 pins), CAN (C20.2 U3.3), Connectors (J8.1 J8.2)
24V: PowerSupplies (A1.1 C14.2), Connectors (F1.2 J6.1 J6.2)
GND: MCU (24 pins), PowerSupplies (11 pins), CAN (6 pins), Connectors (J9.1 J9.2 X1.2), WifiModule (5 pins), SD_card (C26.1 X2.0 X2.6), Accelerometer (10 pins), GPS (10 pins)
Accel_CS: Connectors (J4.1), Accelerometer (U5.22 U6.17)
CAN_H: CAN (D6.2 SW2.5 U3.7), Connectors (X1.4)
CAN_L: CAN (D6.1 SW2.2 U3.6), Connectors (X1.3)
CAN_Rx: MCU (U1.59), CAN (U3.4)
CAN_Tx: MCU (U1.60), CAN (U3.1)
CS_SD: MCU (U1.57), Connectors (J5.4), SD_card (X2.2)
GPS_Rx: MCU (R6.2), Connectors (J2.2), GPS (U4.10)
GPS_Tx: MCU (R5.2), Connectors (J2.1), GPS (U4.9)
MCU_ACCEL_CS: MCU (U1.31), Accelerometer (U6.4)
MCU_ACCEL_INT: MCU (U1.24), Accelerometer (U6.3)
MCU_ACCEL_OE: MCU (U1.23), Accelerometer (R19.2 U6.10)
MCU_ACCEL_SCLK: MCU (U1.30), Accelerometer (U6.5)
MCU_ACCEL_SIMO: MCU (U1.29), Accelerometer (U6.6)
MCU_ACCEL_SOMI: MCU (U1.28), Accelerometer (U6.7)
MISO_SD: MCU (U1.1), Connectors (J5.1), SD_card (X2.7)
MOSI_SD: MCU (U1.4), Connectors (J5.3), SD_card (X2.3)
SCLK_SD: MCU (U1.58), Connectors (J5.2), SD_card (X2.5)
STB_MODE: MCU (U1.61), CAN (R13.2 U3.8)
Wifi_ON_SLEEP: MCU (U1.8), WifiModule (A4.13)
Wifi_Reset: MCU (U1.7), WifiModule (A4.5 C25.2 R16.1 SW3.2)
Wifi_SLEEP_RQ: MCU (U1.9), WifiModule (A4.9)
Wifi_SPI_CLK: MCU (U1.19), Connectors (J3.2), WifiModule (A4.18)
Wifi_SPI_MISO: MCU (U1.21), Connectors (J3.5), WifiModule (A4.4)
Wifi_SPI_MOSI: MCU (U1.22), Connectors (J3.4), WifiModule (A4.11)
Wifi_SPI_nATTN: MCU (U1.6), Connectors (J3.1), WifiModule (A4.19)
Wifi_SPI_SSEL: MCU (U1.20), Connectors (J3.3), WifiModule (A4.17)